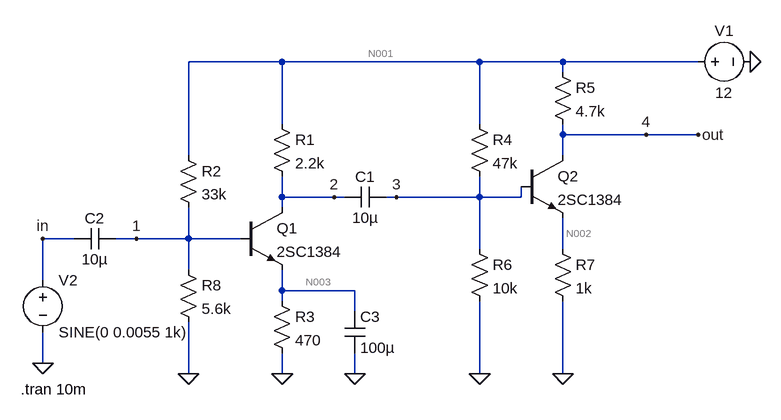
[diagram p0: schematic Draft1.asc]
Draft1.asc, the LTspice schematic file:
Version 4
SHEET 1 880 680
WIRE -208 -48 -352 -48
WIRE 96 -48 -208 -48
WIRE 224 -48 96 -48
WIRE 432 -48 224 -48
WIRE 224 -32 224 -48
WIRE -208 48 -208 -48
WIRE 96 48 96 -48
WIRE 224 64 224 48
WIRE 352 64 224 64
WIRE 432 64 352 64
WIRE -352 96 -352 -48
WIRE 224 96 224 64
WIRE -208 160 -208 128
WIRE -128 160 -208 160
WIRE -112 160 -128 160
WIRE -32 160 -48 160
WIRE 96 160 96 128
WIRE 96 160 -32 160
WIRE 160 160 160 144
WIRE 160 160 96 160
WIRE -208 176 -208 160
WIRE -528 224 -576 224
WIRE -432 224 -464 224
WIRE -352 224 -352 176
WIRE -352 224 -432 224
WIRE -272 224 -352 224
WIRE 96 240 96 160
WIRE 224 240 224 192
WIRE -352 272 -352 224
WIRE -576 288 -576 224
WIRE -208 304 -208 272
WIRE -96 304 -208 304
WIRE -208 320 -208 304
WIRE -96 336 -96 304
WIRE -576 416 -576 368
WIRE -352 432 -352 352
WIRE -208 432 -208 400
WIRE -96 432 -96 400
WIRE 96 432 96 320
WIRE 224 432 224 320
FLAG -352 432 0
FLAG -208 432 0
FLAG 96 432 0
FLAG 224 432 0
FLAG -576 224 in
FLAG 432 64 out
FLAG -432 224 1
FLAG -128 160 2
FLAG -32 160 3
FLAG 352 64 4
FLAG -576 416 0
FLAG 512 -48 0
FLAG -96 432 0
SYMBOL npn -272 176 R0
SYMATTR InstName Q1
SYMATTR Value 2SC1384
SYMBOL npn 160 96 R0
SYMATTR InstName Q2
SYMATTR Value 2SC1384
SYMBOL res -224 32 R0
SYMATTR InstName R1
SYMATTR Value 2.2k
SYMBOL res -368 80 R0
SYMATTR InstName R2
SYMATTR Value 33k
SYMBOL res -224 304 R0
SYMATTR InstName R3
SYMATTR Value 470
SYMBOL res 80 32 R0
SYMATTR InstName R4
SYMATTR Value 47k
SYMBOL res 208 -48 R0
SYMATTR InstName R5
SYMATTR Value 4.7k
SYMBOL res 80 224 R0
SYMATTR InstName R6
SYMATTR Value 10k
SYMBOL res 208 224 R0
SYMATTR InstName R7
SYMATTR Value 1k
SYMBOL cap -48 144 R90
WINDOW 0 0 32 VBottom 2
WINDOW 3 32 32 VTop 2
SYMATTR InstName C1
SYMATTR Value 10µ
SYMBOL cap -464 208 R90
WINDOW 0 0 32 VBottom 2
WINDOW 3 32 32 VTop 2
SYMATTR InstName C2
SYMATTR Value 10µ
SYMBOL res -368 256 R0
SYMATTR InstName R8
SYMATTR Value 5.6k
SYMBOL voltage 416 -48 R270
WINDOW 0 32 56 VTop 2
WINDOW 3 -32 56 VBottom 2
WINDOW 123 0 0 Left 0
WINDOW 39 0 0 Left 0
SYMATTR InstName V1
SYMATTR Value 12
SYMBOL voltage -576 272 R0
WINDOW 123 0 0 Left 0
WINDOW 39 0 0 Left 0
SYMATTR InstName V2
SYMATTR Value SINE(0 0.0055 1k)
SYMBOL cap -112 336 R0
SYMATTR InstName C3
SYMATTR Value 100µ
TEXT -610 456 Left 2 !.tran 10m

The netlist it stands for:
* Draft1.asc
Q1 2 1 N003 0 2SC1384
Q2 4 3 N002 0 2SC1384
R1 N001 2 2.2k
R2 N001 1 33k
R3 N003 0 470
R4 N001 3 47k
R5 N001 4 4.7k
R6 3 0 10k
R7 N002 0 1k
C1 3 2 10µ
C2 1 in 10µ
R8 1 0 5.6k
V1 N001 0 12
V2 in 0 SINE(0 0.0055 1k)
C3 N003 0 100µ
.model NPN NPN
.model PNP PNP
.lib standard.bjt
.tran 10m
.backanno
.end

* Results of the author's LTspice run, read from the files saved beside the schematic
* Operating Point, zero values left out:
*   V(2) = 7.268 V
*   V(1) = 1.653 V
*   V(n003) = 1.02 V
*   V(4) = 5.589 V
*   V(3) = 1.999 V
*   V(n002) = 1.377 V
*   V(n001) = 12 V
*   Ic(Q1) = 2.151 mA
*   Ib(Q1) = 18.43 µA
*   Ie(Q1) = -2.169 mA
*   Ic(Q2) = 1.364 mA
*   Ib(Q2) = 12.9 µA
*   Ie(Q2) = -1.377 mA
*   I(R1) = 2.151 mA
*   I(R2) = 313.6 µA
*   I(R3) = 2.169 mA
*   I(R4) = 212.8 µA
*   I(R5) = 1.364 mA
*   I(R6) = 199.9 µA
*   I(R7) = 1.377 mA
*   I(R8) = 295.1 µA
*   I(V1) = -4.041 mA
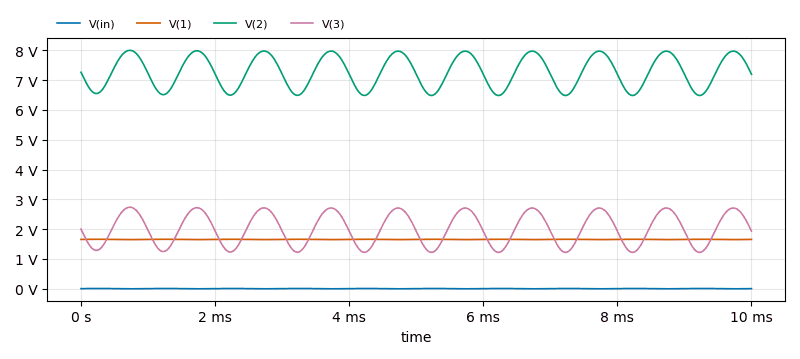
[diagram p1: Transient Analysis of Draft1.asc, plotted from the saved traces]
* Transient Analysis, 1 run:
*   V(in): min -5.5 mV, max 5.5 mV, average -57.4 nV, rms 3.89 mV, last 0 V
*   V(1): min 1.647 V, max 1.658 V, average 1.653 V, rms 1.653 V, last 1.653 V
*   V(2): min 6.486 V, max 8.002 V, average 7.275 V, rms 7.294 V, last 7.199 V
*   V(3): min 1.218 V, max 2.733 V, average 2.006 V, rms 2.073 V, last 1.929 V